# Altium schematic sheet Overview.SchDoc
size A4; SheetNumber: 1; SheetTotal: 4
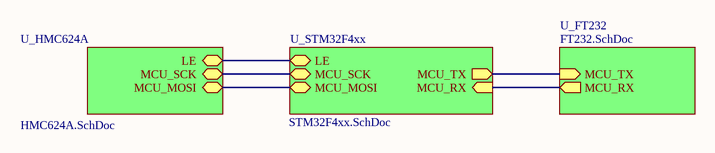
[diagram p0: Overview.SchDoc]

## Sub-sheets
U_FT232 = FT232.SchDoc: MCU_TX (in), MCU_RX (out)
U_HMC624A = HMC624A.SchDoc: LE (bidir), MCU_SCK (bidir), MCU_MOSI (bidir)
U_STM32F4xx = STM32F4xx.SchDoc: MCU_TX (out), MCU_RX (in), MCU_MOSI (bidir), MCU_SCK (bidir), LE (bidir)

## Nets
(unnamed): sheet U_HMC624A/LE, sheet U_STM32F4xx/LE
(unnamed): sheet U_HMC624A/MCU_SCK, sheet U_STM32F4xx/MCU_SCK
(unnamed): sheet U_HMC624A/MCU_MOSI, sheet U_STM32F4xx/MCU_MOSI
(unnamed): sheet U_STM32F4xx/MCU_TX, sheet U_FT232/MCU_TX
(unnamed): sheet U_STM32F4xx/MCU_RX, sheet U_FT232/MCU_RX